# EAGLE design vetinari (EAGLE 6.4)
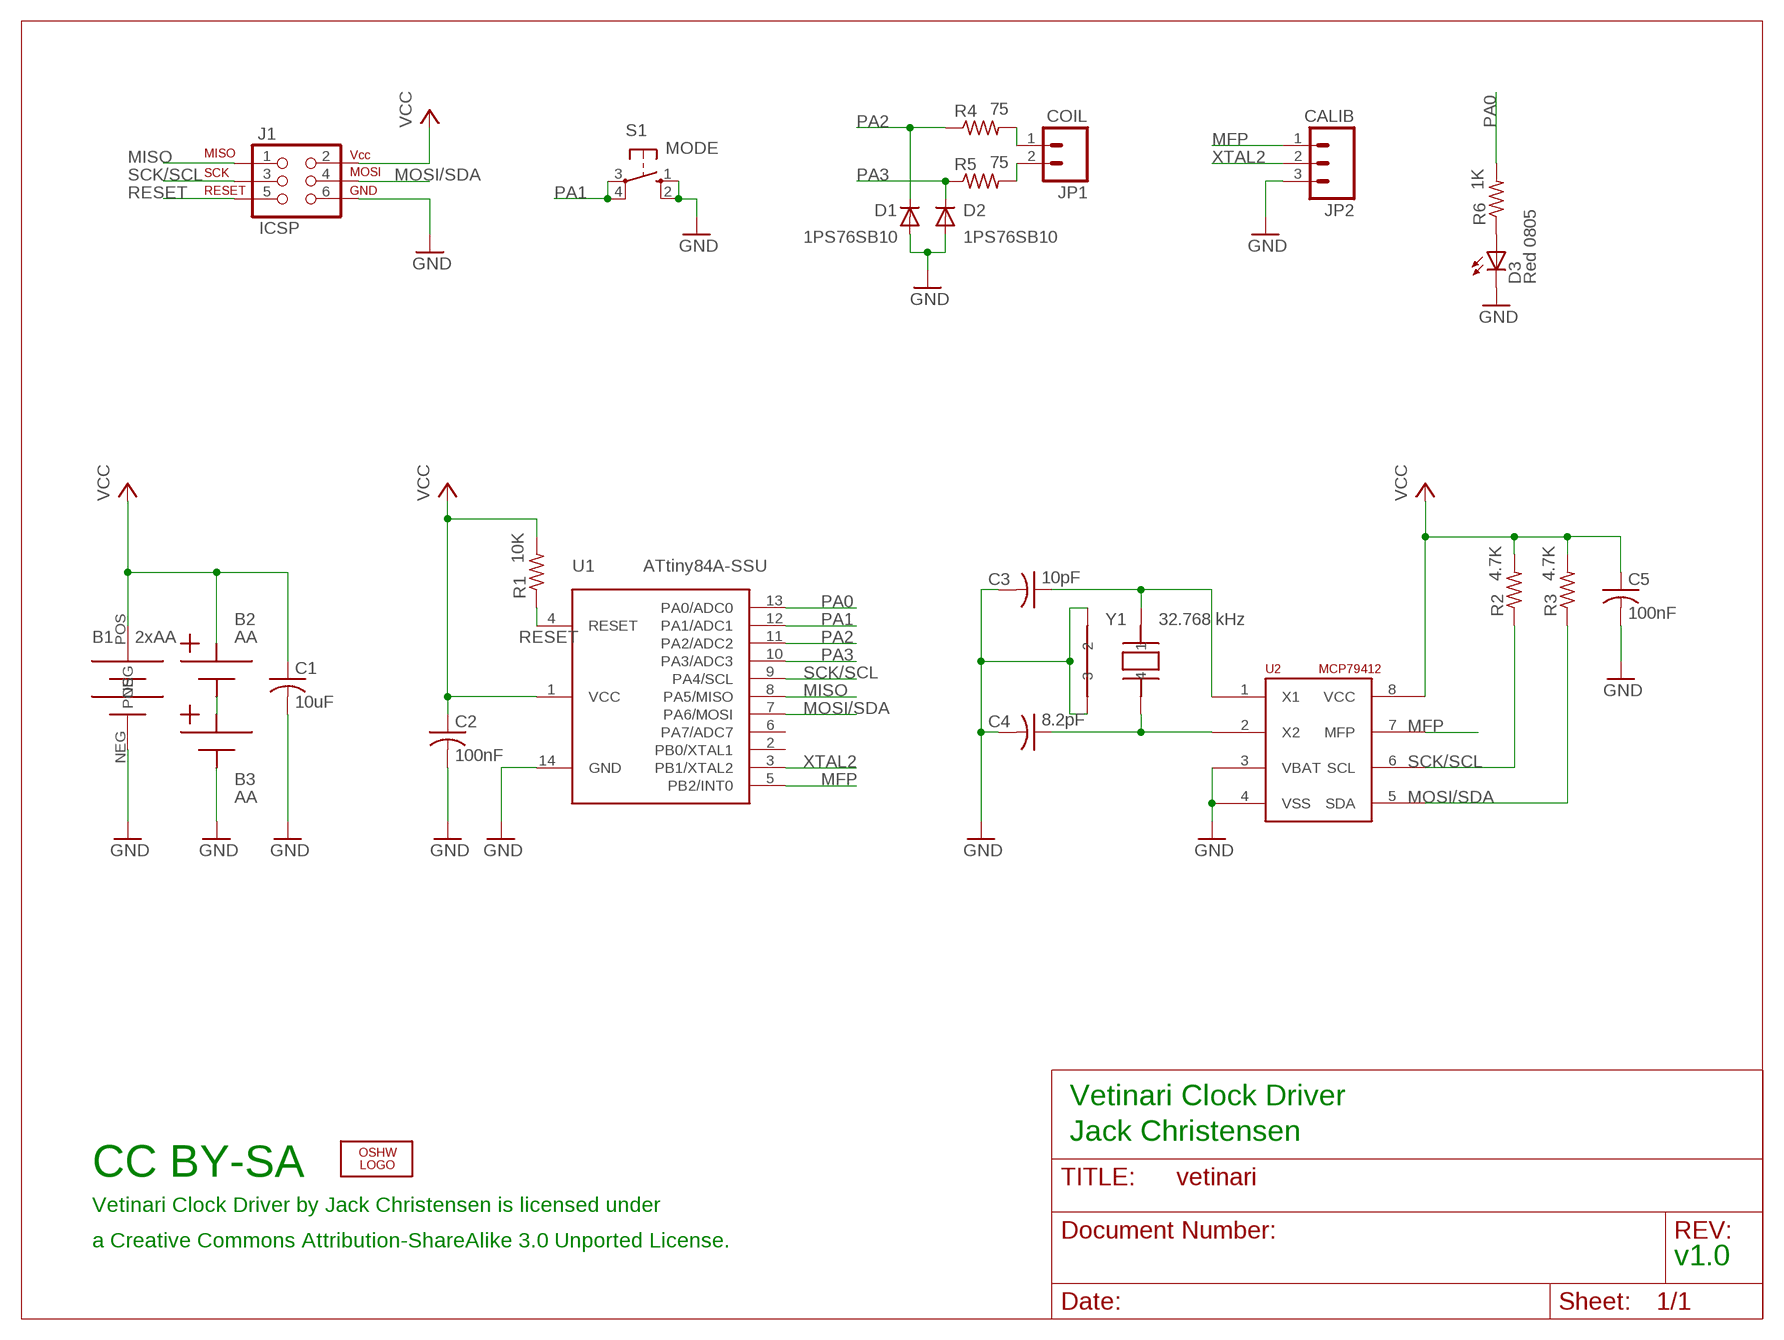
[diagram p0: schematic, sheet 1]

## Parts
B1  2xAA  BATTERY-2AAOUTLINE  [KEYSTONE-2462-OUTLINE]
B2  AA  BATTERY-AAKEYSTONE-92  [BATT-AA-PC-CLIPS]
B3  AA  BATTERY-AAKEYSTONE-92  [BATT-AA-PC-CLIPS]
C1  10uF  C-USM1206  [M1206]
C2  100nF  C-USM0805  [M0805]
C3  10pF  C-USM0805  [M0805]
C4  8.2pF  C-USM0805  [M0805]
C5  100nF  C-USM0805  [M0805]
D1  1PS76SB10  DIODESOD-323F  [SOD-323F]
D2  1PS76SB10  DIODESOD-323F-A  [SOD-323F-A]
D3  Red 0805  LEDD0805  [D0805]
J1  ICSP  AVR_SPI_PRG_62X3_LOCK  [2X3_LOCK]
JP1  COIL  M02PTH  [1X02]
JP2  CALIB  M03LOCK  [1X03_LOCK]
LOGO2  OSHW_LOGO_8MILX0150-NT  [OSHW_8X150_NOTEXT]
R1  10K  R-US_M0805  [M0805]
R2  4.7K  R-US_M0805  [M0805]
R3  4.7K  R-US_M0805  [M0805]
R4  75  R-US_M0805  [M0805]
R5  75  R-US_M0805  [M0805]
R6  1K  R-US_M0805  [M0805]
S1  MODE  10-XXOCT  [B3F-10XXOCT]
U1  ATtiny84A-SSU  ATTINYX4SO14  [SO14]
U2  MCP79412  MCP7941X-SOIC-8  [SO08]
Y1  32.768 kHz  CRYSTAL-CITIZEN-CM2XXC  [CRYSTAL-CITIZEN-CM2XXC]

## Nets
GND: B1.NEG B3.N1 B3.N2 C1.2 C2.2 C3.2 C4.2 C5.2 D1.A D2.A D3.K(C) J1.6 JP2.3 S1.1(S) S1.2(S1) U1.14(GND) U2.3(VBAT) U2.4(VSS) Y1.P$2 Y1.P$3
MFP: JP2.1 U1.5(PB2/INT0) U2.7(MFP)
MISO: J1.1 U1.8(PA5/MISO)
MOSI/SDA: J1.4 R3.1 U1.7(PA6/MOSI) U2.5(SDA)
N$1: JP1.1 R4.2
N$2: C4.1 U2.2(X2) Y1.P$4
N$3: C3.1 U2.1(X1) Y1.P$1
N$4: JP1.2 R5.2
N$5: D3.A R6.1
N$6: B2.N1 B2.N2 B3.P1 B3.P2
PA0: R6.2 U1.13(PA0/ADC0)
PA1: S1.3(P) S1.4(P1) U1.12(PA1/ADC1)
PA2: D1.K R4.1 U1.11(PA2/ADC2)
PA3: D2.K R5.1 U1.10(PA3/ADC3)
RESET: J1.5 R1.1 U1.4(RESET)
SCK/SCL: J1.3 R2.1 U1.9(PA4/SCL) U2.6(SCL)
VCC: B1.POS B2.P1 B2.P2 C1.1 C2.1 C5.1 J1.2 R1.2 R2.2 R3.2 U1.1(VCC) U2.8(VCC)
XTAL2: JP2.2 U1.3(PB1/XTAL2)
Unconnected: U1.2(PB0/XTAL1) U1.6(PA7/ADC7)

## Notes on the sheet
- Vetinari Clock Driver
- Jack Christensen
- CC BY-SA
- Vetinari Clock Driver by Jack Christensen is licensed under
- a Creative Commons Attribution-ShareAlike 3.0 Unported License.
- v1.0

## Library data of the parts
B1 = _jc:BATTERY-2AA
B2 B3 = _jc:BATTERY-AA
C1-C5 = _jc:C-US: CAPACITOR, American symbol
D1 D2 = _jc:DIODE
D3 = _jc:LED: LED OSRAM: - CHIPLED LG R971, LG N971, LY N971, LG Q971, LY Q971, LO R971, LY R971 LH N974, LH R974 LS Q976, LO Q976, LY Q976 LO Q996 - Hyper CHIPLED LW Q18S LB Q993, LB Q99A, LB R99A - SideLED LS A670, LO A670, LY A670, LG A670, LP A670 LB A673, LV A673, LT A673, LW A673 LH A674 LY A675 LS A676, LA A676, LO A676, LY A676, LW A676 LS A679, LY A679, LG A679 - Hyper Micro SIDELED® LS Y876, LA Y876, LO Y876, LY Y876 LT Y87S - SmartLED LW L88C, LW L88S LB L89C, LB L89S, LG L890 LS L89K, LO L89K, LY L89K LS L896, LA L896, LO L896, LY L896 - TOPLED LS T670, LO T670, LY T670, LG T670, LP T670 LSG T670, LSP T670, LSY T670, LOP T670, LYG T670 LG T671, LOG T671, LSG T671 LB T673, LV T673, LT T673, LW T673 LH T674 LS T676, LA T676, LO T676, LY T676, LB T676, LH T676, LSB T676, LW T676 LB T67C, LV T67C, LT T67C, LS T67K, LO T67K, LY T67K, LW E67C LS E67B, LA E67B, LO E67B, LY E67B, LB E67C, LV E67C, LT E67C LW T67C LS T679, LY T679, LG T679 LS T770, LO T770, LY T770, LG T770, LP T770 LB T773, LV T773, LT T773, LW T773 LH T774 LS E675, LA E675, LY E675, LS T675 LS T776, LA T776, LO T776, LY T776, LB T776 LHGB T686 LT T68C, LB T68C - Hyper Mini TOPLED® LB M676 - Mini TOPLED Santana® LG M470 LS M47K, LO M47K, LY M47K Source: http://www.osram.convergy.de/
J1 = _jc:AVR_SPI_PRG_6: AVR ISP 6 Pin This is the reduced ISP connector for AVR programming. Common on Arduino. This footprint will take up less PCB space and can be used with a 10-pin to 6-pin adapter such as SKU: BOB-08508
JP1 = SparkFun:M02: Header 2 Standard 2-pin 0.1" header. Use with straight break away headers (SKU : PRT-00116), right angle break away headers (PRT-00553), swiss pins (PRT-00743), machine pins (PRT-00117), and female headers (PRT-00115). Molex polarized connector foot print use with SKU : PRT-08233 with associated crimp pins and housings.
JP2 = SparkFun:M03: Header 3 Standard 3-pin 0.1" header. Use with straight break away headers (SKU : PRT-00116), right angle break away headers (PRT-00553), swiss pins (PRT-00743), machine pins (PRT-00117), and female headers (PRT-00115). Molex polarized connector foot print use with SKU : PRT-08232 with associated crimp pins and housings.
LOGO2 = ohw-logo:OSHW_LOGO_8MIL
R1-R6 = _jc:R-US_: RESISTOR, American symbol
S1 = _jc:10-XX: OMRON SWITCH
U1 = _jc:ATTINYX4
U2 = _jc:MCP7941X
Y1 = _jc:CRYSTAL-CITIZEN-CM2XXC

## Board
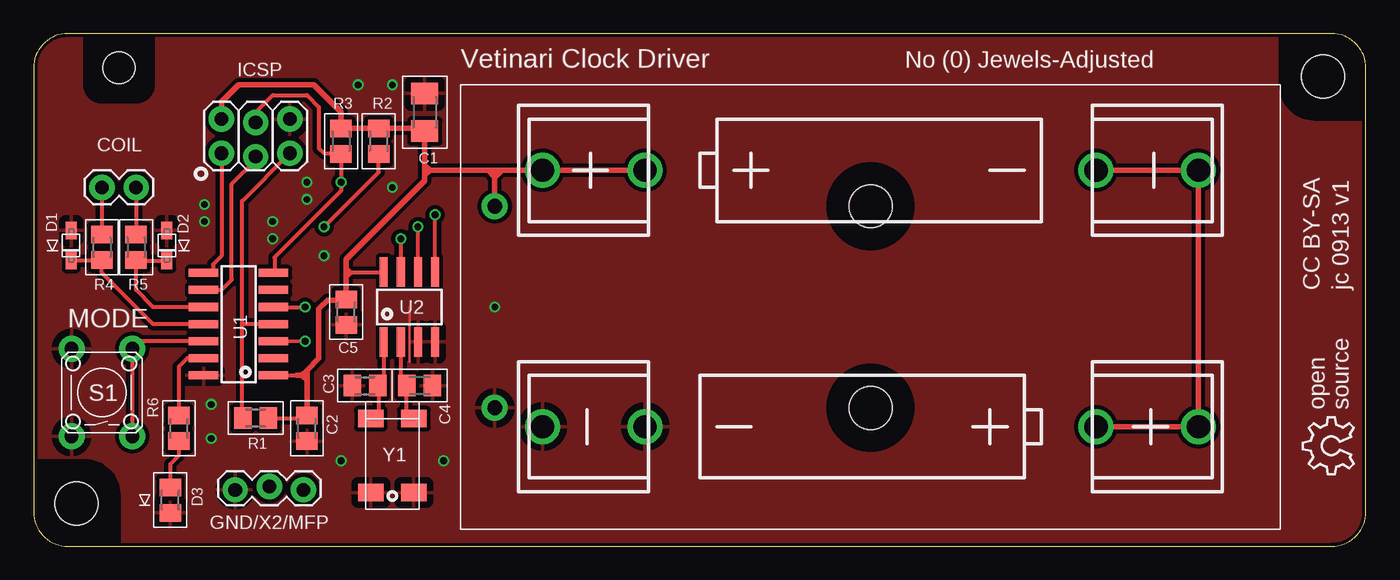
[diagram p1: board, top side]
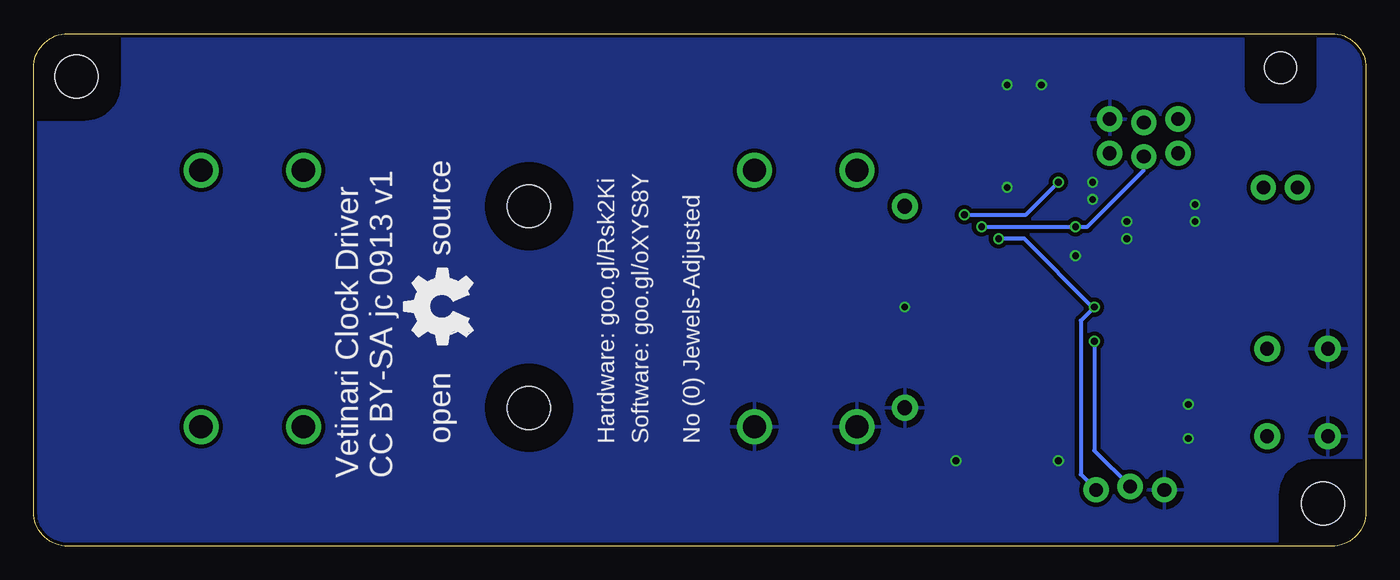
[diagram p2: board, bottom side, seen from below]

Size 99.06 x 38.1 mm. Coordinates in mm from the lower left corner, seen from the top.
Outline: 0,35.56 0,2.54 arc90 2.54,0 96.52,0 arc90 99.06,2.54 99.06,35.56 arc90 96.52,38.1 2.54,38.1 arc90 0,35.56
Copper layers (1*16): Top 0.035mm / dielectric 1.5mm / Bottom 0.035mm
Design rules "Fusion_eagle_rule_v1.1 *": minimum track width 8mil, minimum drill 12mil, track to track 12mil, track to pad 12mil, pad to pad 12mil, via to via 12mil, smd to smd 0mil, copper to edge 10mil, drill to drill 10mil, minimum pad ring 10mil, minimum via ring 6mil, stop-mask expansion 2mil, vias tented up to drill 100mil, thermal gap 20mil
Holes 3.2 mm at 3.17,3.17 95.89,34.92
Holes 2.38 mm at 6.35,35.56
tRestrict: area 0,0 to 6.3,6.3; area 92.7,31.8 to 99.1,38.1; area 3.8,33 to 8.9,38.1
bRestrict: area 0,0 to 6.3,6.3; area 92.7,31.8 to 99.1,38.1; area 3.8,33 to 8.9,38.1

### Footprints (pad centres in the part's own frame; a part is rotated, then mirrored left to right if it is on the bottom)
KEYSTONE-2462-OUTLINE = drill 1.1 pad 1.93: NEG -27.94,-7.493; POS -27.94,7.493 | hole 3.2: 0,7.493; 0,-7.493
BATT-AA-PC-CLIPS = drill 1.727: N1 16.764,0; N2 24.384,0; P1 -24.384,0; P2 -16.764,0
M1206 = smd 1.6 x 2: 1 -1.4,0; 2 1.4,0
M0805 = smd 1.3 x 1.6: 1 -0.95,0; 2 0.95,0
SOD-323F = smd 1.27 x 0.813: A -1.118,0; K 1.118,0
SOD-323F-A = smd 1.27 x 0.813: A -1.118,0; K 1.118,0
D0805 = smd 1.3 x 1.6: A -0.95,0; K 0.95,0
2X3_LOCK = drill 1.016 pad 1.88: 1 0,0; 2 0,2.54; 3 2.54,-0.254; 4 2.54,2.286; 5 5.08,0; 6 5.08,2.54
1X02 = drill 1.016 pad 1.88: 1 0,0; 2 2.54,0
1X03_LOCK = drill 1.016 pad 1.88: 1 0,0.127; 2 2.54,-0.127; 3 5.08,0.127
B3F-10XXOCT = drill 1.016 pad 1.93: 1 -3.251,2.261; 2 3.251,2.261; 3 -3.251,-2.261; 4 3.251,-2.261
SO14 = smd 0.6 x 2.2: 1 -3.81,-2.6; 2 -2.54,-2.6; 3 -1.27,-2.6; 4 0,-2.6; 5 1.27,-2.6; 6 2.54,-2.6; 7 3.81,-2.6; 8 3.81,2.6; 9 2.54,2.6; 10 1.27,2.6; 11 0,2.6; 12 -1.27,2.6; 13 -2.54,2.6; 14 -3.81,2.6
SO08 = smd 0.6 x 2.2: 1 -1.905,-2.6; 2 -0.635,-2.6; 3 0.635,-2.6; 4 1.905,-2.6; 5 1.905,2.6; 6 0.635,2.6; 7 -0.635,2.6; 8 -1.905,2.6
CRYSTAL-CITIZEN-CM2XXC = smd 1.3 x 1.9: P$1 -2.75,-1.6; P$2 2.75,-1.6; P$3 2.75,1.6; P$4 -2.75,1.6

### Placement (x,y rotation side)
B1  62.23,17.78 0 top
B2  62.23,27.94 0 top
B3  62.23,8.89 180 top
C1  29.08,32.26 90 top
C2  20.32,8.76 270 top
C3  24.64,11.94 180 top
C4  28.7,11.94 0 top
C5  23.24,17.4 270 top
D1  2.79,22.35 270 top
D2  9.91,22.35 270 top
D3  10.16,3.43 270 top
J1  13.97,29.21 0 top
JP1  5.08,26.67 0 top
JP2  20.07,4.32 180 top
LOGO2  98.17,5.33 90 top
R1  16.51,9.53 0 top
R2  25.65,30.1 90 top
R3  22.86,30.1 90 top
R4  5.08,22.23 90 top
R5  7.62,22.23 90 top
R6  10.79,8.76 90 top
S1  5.08,11.43 90 top
U1  15.24,16.51 90 top
U2  27.94,17.78 0 top
U$1  [OSHW_FILLX200_NOTEXT]  66.42,14.99 90 bottom
Y1  26.67,6.73 270 top

### Tracks (layer width: path | path; a pad name or v marks a point on that pad's centre or on a via)
GND  (via drill 0.5)
  Top 0.203: 27.94,17.78 27.94,13.72
  other vias: 13.21,10.54 20.32,27.05 17.78,24.13 12.7,24.13 13.21,8 12.7,25.4 17.78,22.86 20.32,25.78 21.59,21.59 26.67,26.67 30.48,6.35 22.86,6.35 26.67,34.29 24.13,34.29 34.29,17.78
  pour Bottom: -2.54,40.64 101.6,40.64 101.6,-2.54 -2.54,-2.54
  pour Top: -1.27,39.37 100.33,39.37 100.33,-1.27 -1.27,-1.27
MFP  (via drill 0.5)
  Top 0.305: U1.5 v20.19,17.78 | v27.3,22.86 U2.7
  Bottom 0.305: v27.3,22.86 25.4,22.86 20.32,17.78 v20.19,17.78 21.21,16.76 21.21,5.33 JP2.1
MISO
  Top 0.305: J1.1 13.97,21.59 13.34,20.95 13.34,20.19 13.21,20.32 U1.8
MOSI/SDA  (via drill 0.5)
  Top 0.305: U2.5 v29.84,24.64 | J1.4 16.51,32.26 17.78,33.53 20.32,33.53 21.21,32.64 21.21,29.59 21.59,29.21 22.8,29.21 R3.1 v22.86,27.05 22.86,26.42 17.91,21.46 17.91,20.39 U1.7
  Bottom 0.305: v29.84,24.64 25.27,24.64 v22.86,27.05
N$1
  Top 0.305: JP1.1 R4.2
N$2
  Top 0.305: U2.2 27.3,12.57 27.75,12.13 C4.1 27.69,11.87 27.69,9.65 27.86,9.48 Y1.P$4
N$3
  Top 0.305: U2.1 26.04,12.19 25.78,11.94 C3.1 25.65,11.87 25.65,9.65 25.48,9.48 Y1.P$1
N$4
  Top 0.305: JP1.2 R5.2
N$5
  Top 0.305: R6.1 10.79,6.73 10.16,6.1 D3.A
N$6
  Top 0.406: B2.N1 B2.N2 B3.P1 B3.P2
PA0
  Top 0.305: U1.13 11.43,13.97 10.79,13.34 R6.2
PA1
  Top 0.305: S1.3 S1.4 7.9,15.24 U1.12
PA2
  Top 0.305: D1.K 5.04,21.23 R4.1 5.08,20.32 8.89,16.51 U1.11
PA3
  Top 0.305: U1.10 8.89,17.78 7.62,19.05 R5.1 7.66,21.23 D2.K
RESET
  Top 0.305: 15.49,16.51 15.49,9.59 R1.1 | 15.49,16.51 15.49,25.65 J1.5 | U1.4 15.49,16.51
SCK/SCL  (via drill 0.5)
  Top 0.305: U2.6 v28.57,23.75 | U1.9 13.97,19.05 14.73,19.81 14.73,26.92 16.51,28.7 J1.3 | v21.59,23.75 25.65,27.81 R2.1
  Bottom 0.305: J1.3 16.51,27.94 20.7,23.75 v21.59,23.75 v28.57,23.75
VCC
  Top 0.305: U2.8 25.98,20.32 23.62,20.32 | U1.1 19.56,12.7 | R1.2 20.13,9.53 C2.1 | 23.62,20.32 23.24,20.32 | 23.24,19.94 23.62,20.32 | 23.62,20.32 23.24,20.7
  Top 0.406: J1.2 13.97,33.02 15.24,34.29 20.83,34.29 22.86,32.26 R3.2 R2.2 28.89,31.05 C1.1 29.08,28.32 | C2.1 20.32,12.32 | 20.32,12.32 20.32,12.7 | 20.32,12.7 20.32,13.08 | 20.32,13.08 21.21,13.97 21.21,17.65 21.84,18.29 23.18,18.29 C5.1 23.24,19.94 23.24,20.32 23.24,20.7 23.24,21.34 29.08,27.18 29.08,27.56 | 19.56,12.7 19.94,12.7 | 19.94,12.7 20.32,12.7 | B2.P2 B2.P1 34.8,27.94 | 29.08,28.32 29.08,27.94 | 29.08,27.94 29.08,27.56 | 34.8,27.94 34.29,27.94 | 34.29,27.94 33.78,27.94 | 33.78,27.94 29.46,27.94 | 29.46,27.94 29.08,27.94 | B1.POS 34.29,27.43 | 34.29,27.43 34.29,27.94 | 29.46,27.94 29.08,27.56 | 29.46,27.94 29.08,28.32 | 33.78,27.94 34.29,27.43 | 34.29,27.43 34.8,27.94 | 20.32,13.08 19.94,12.7 | 19.94,12.7 20.32,12.32
XTAL2  (via drill 0.5)
  Top 0.254: U1.3 v20.19,15.24
  Bottom 0.305: v20.19,15.24 20.19,7.11 JP2.2

### Text on the board
tPlace: Vetinari Clock Driver | No (0) Jewels-Adjusted | ICSP | COIL | CC BY-SA | jc 0913 v1 | MODE | open | source | GND/X2/MFP
bPlace: source | No (0) Jewels-Adjusted | Software: goo.gl/oXYS8Y | Hardware: goo.gl/Rsk2Ki | open | CC BY-SA jc 0913 v1 | Vetinari Clock Driver